# EAGLE design XBee_Ctrl_No_Magnetometer (EAGLE 6.2)
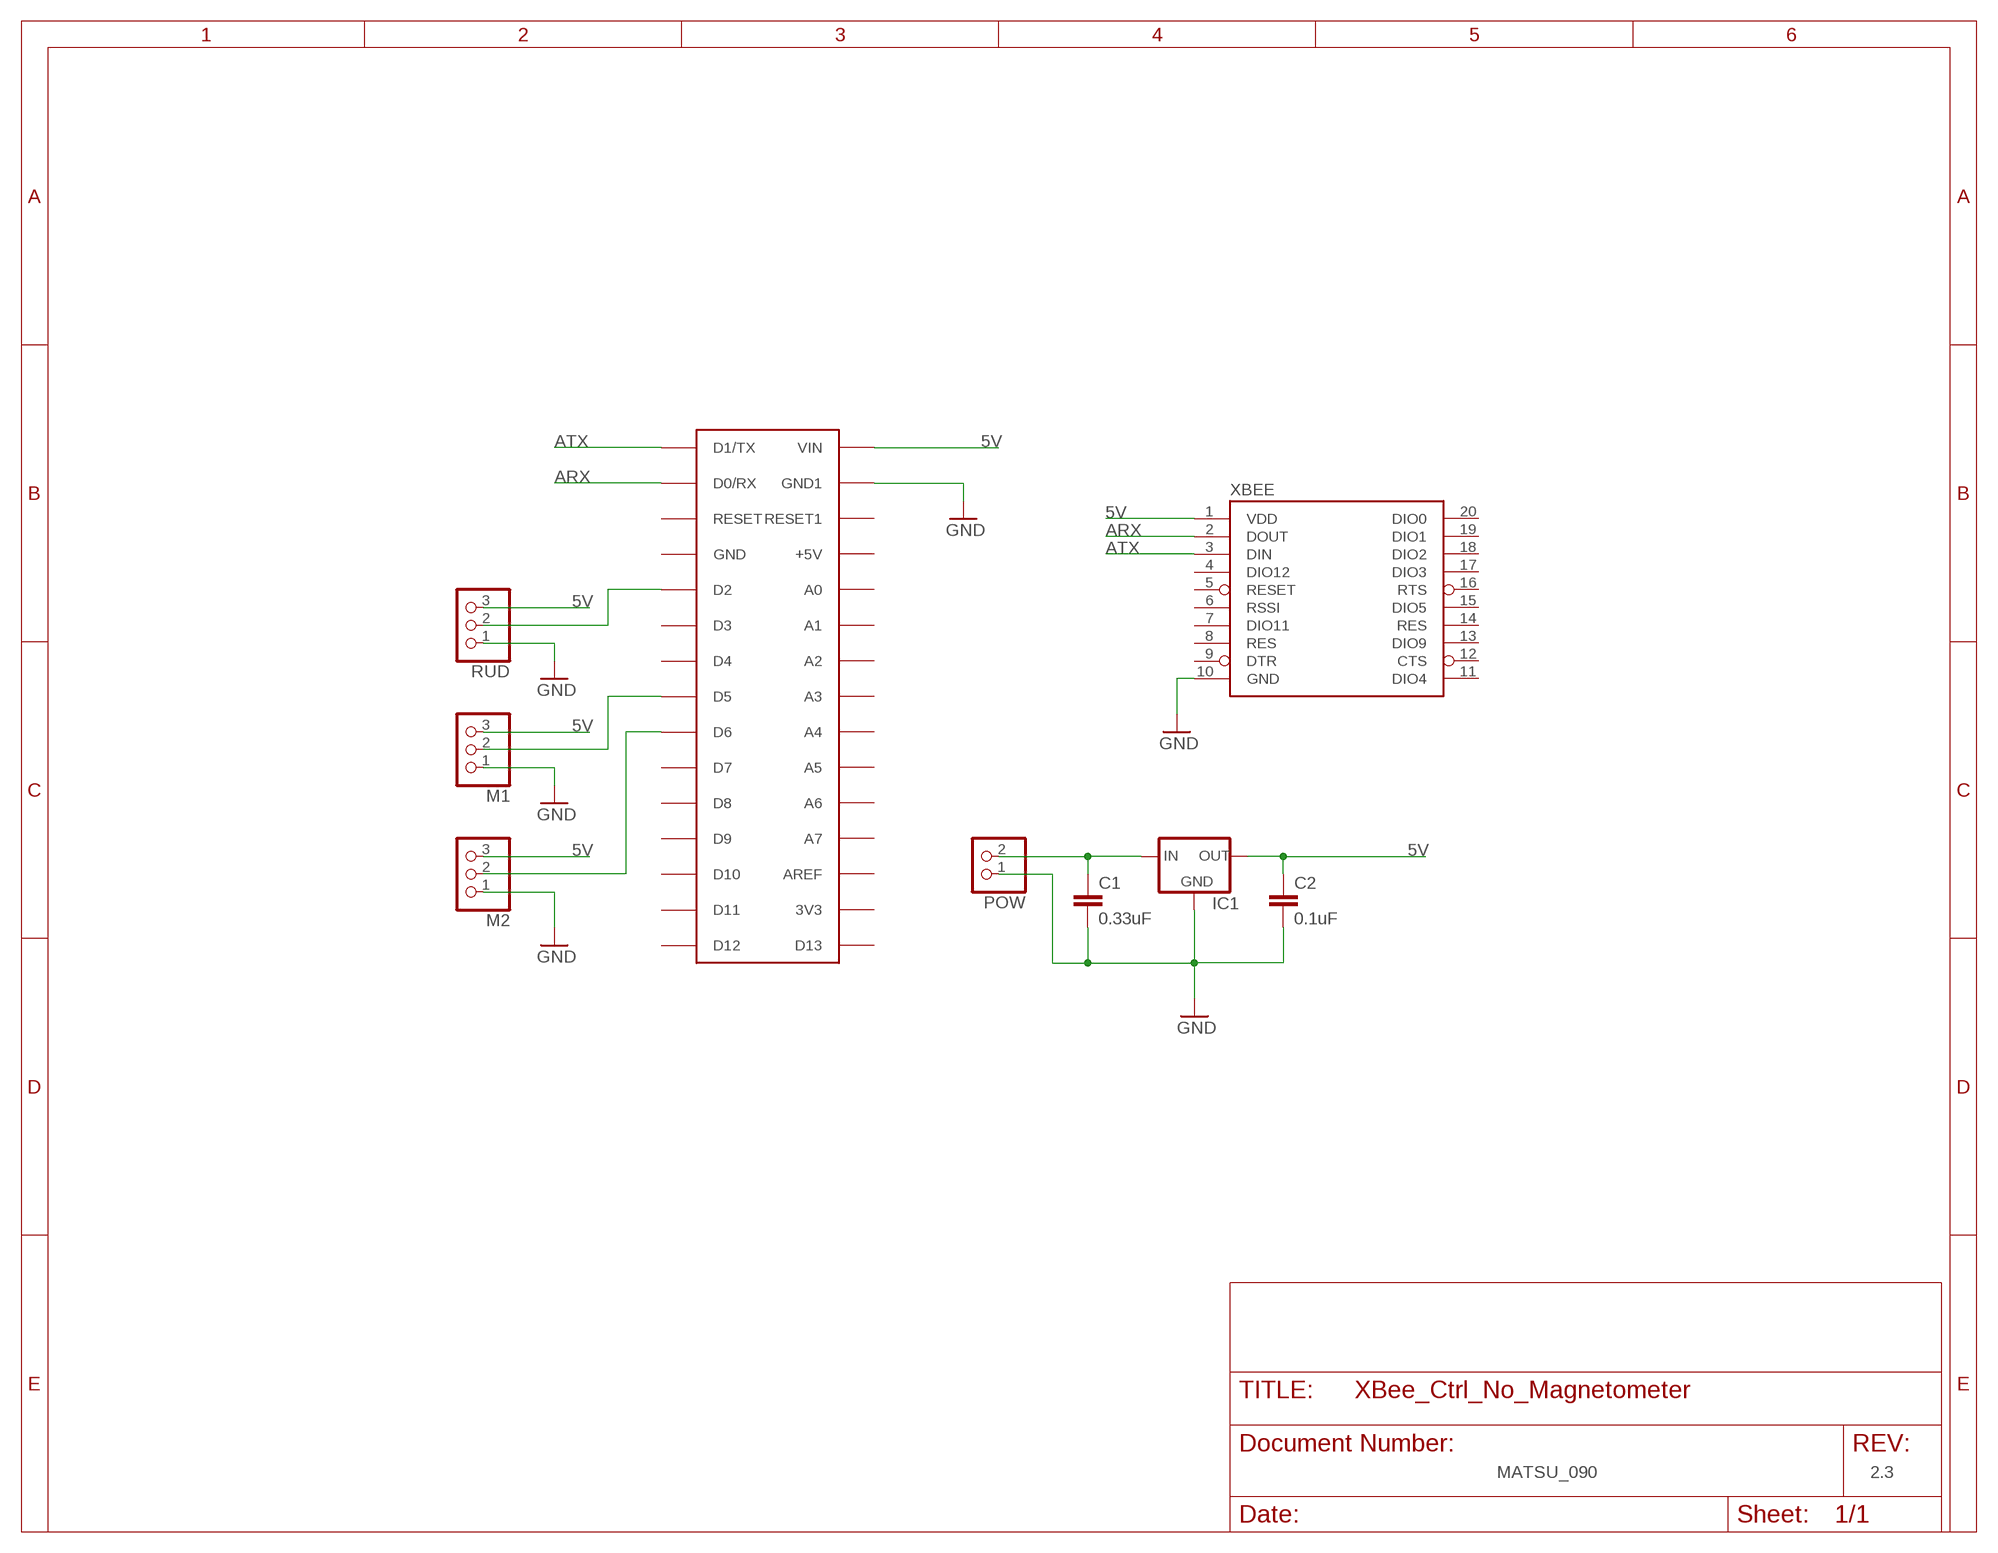
[diagram p0: schematic, sheet 1]
FRAME1 (FRAME_A_L): DOC#: MATSU_090; REV: 2.3

## Parts
C1  0.33uF  C5/2.5  [C5B2.5]
C2  0.1uF  C5/2.5  [C5B2.5]
IC1  78XXL  [78XXL]
M1  PINHD-1X3  [1X03]
M2  PINHD-1X3  [1X03]
NANO  ARDUINONANO  [PDIP-32]
POW  PINHD-1X2  [1X02]
RUD  PINHD-1X3  [1X03]
XBEE  XBEE-1B1  [XBEE-1]

## Nets
5V: C2.1 IC1.OUT M1.3 M2.3 NANO.VIN RUD.3 XBEE.1(VDD)
ARX: NANO.D0/RX XBEE.2(DOUT)
ATX: NANO.D1/TX XBEE.3(DIN)
GND: C1.2 C2.2 IC1.GND M1.1 M2.1 NANO.GND1 POW.1 RUD.1 XBEE.10(GND)
N$2: C1.1 IC1.IN POW.2
N$4: NANO.D2 RUD.2
N$5: M1.2 NANO.D5
N$6: M2.2 NANO.D6
Unconnected: NANO.3V3 NANO.+5V NANO.A0 NANO.A1 NANO.A2 NANO.A3 NANO.A4 NANO.A5 NANO.A6 NANO.A7 NANO.AREF NANO.D3 NANO.D4 NANO.D7 NANO.D8 NANO.D9 NANO.D10 NANO.D11 NANO.D12 NANO.D13 NANO.GND NANO.RESET NANO.RESET1 XBEE.4(DIO12) XBEE.5(RESET) XBEE.6(RSSI) XBEE.7(DIO11) XBEE.8(RES) XBEE.9(DTR) XBEE.11(DIO4) XBEE.12(CTS) XBEE.13(DIO9) XBEE.14(RES) XBEE.15(DIO5) XBEE.16(RTS) XBEE.17(DIO3) XBEE.18(DIO2) XBEE.19(DIO1) XBEE.20(DIO0)

## Library data of the parts
C1 C2 = capacitor-wima:C: CAPACITOR naming: grid - package width
IC1 = v-reg:78XXL: VOLTAGE REGULATOR
M1 M2 RUD = pinhead:PINHD-1X3: PIN HEADER
NANO = arduino_nano_rocketfarm:ARDUINONANO
POW = pinhead:PINHD-1X2: PIN HEADER
XBEE = Sparkfun_RF:XBEE-1: Xbee module footprints

## Board
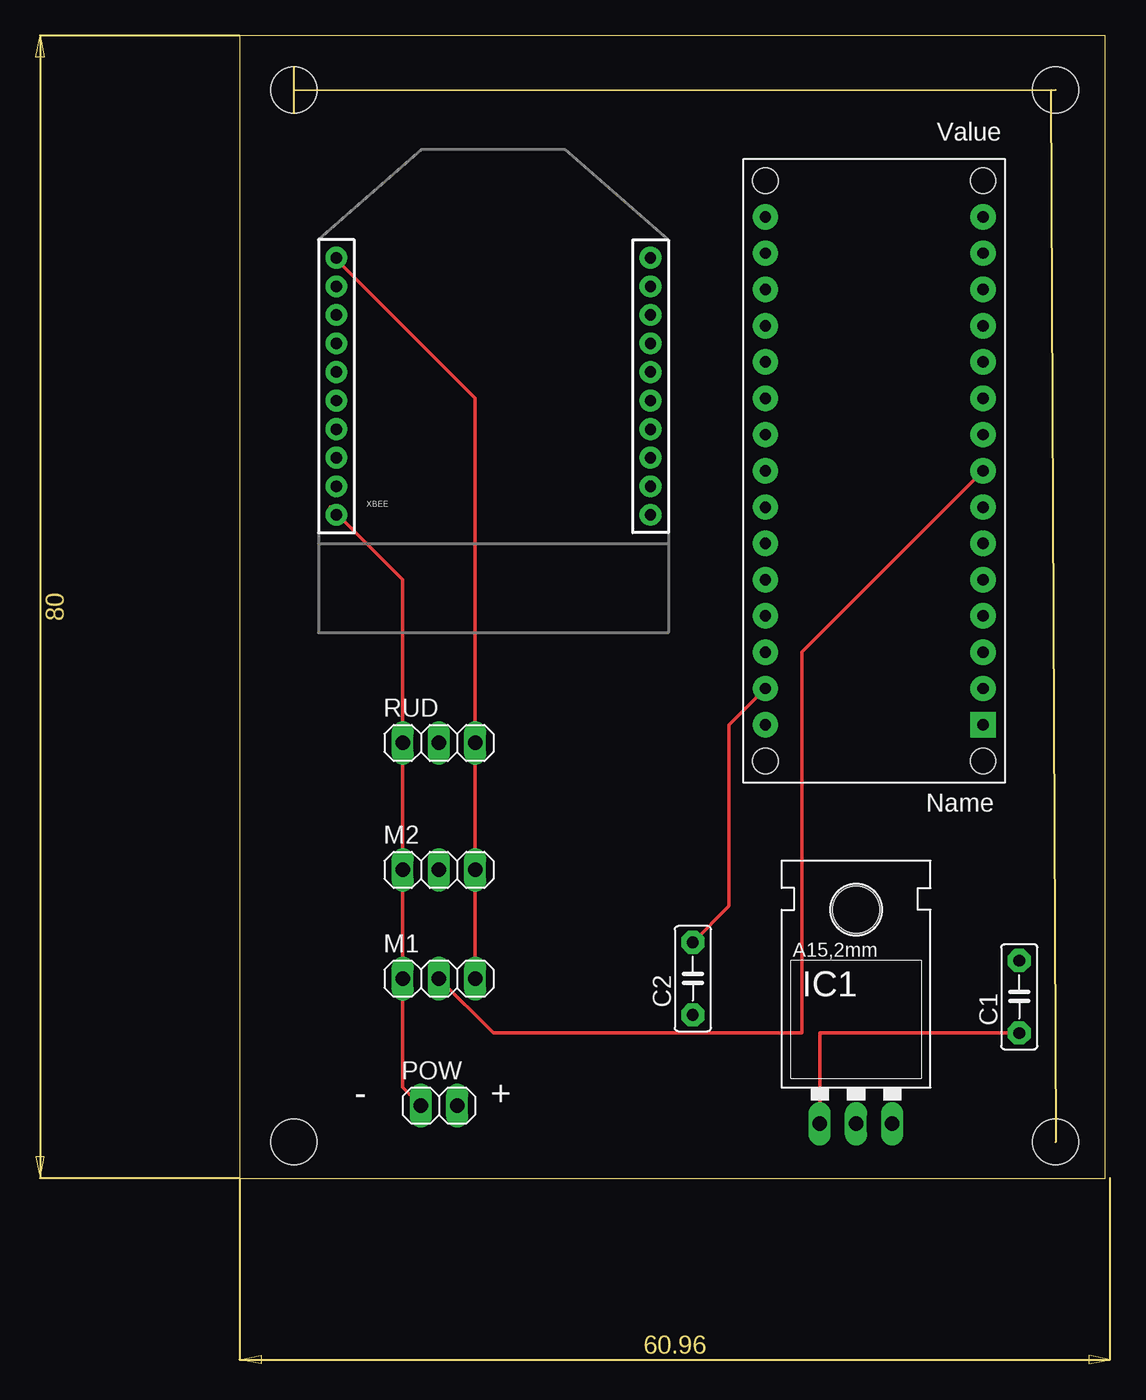
[diagram p1: board, top side]
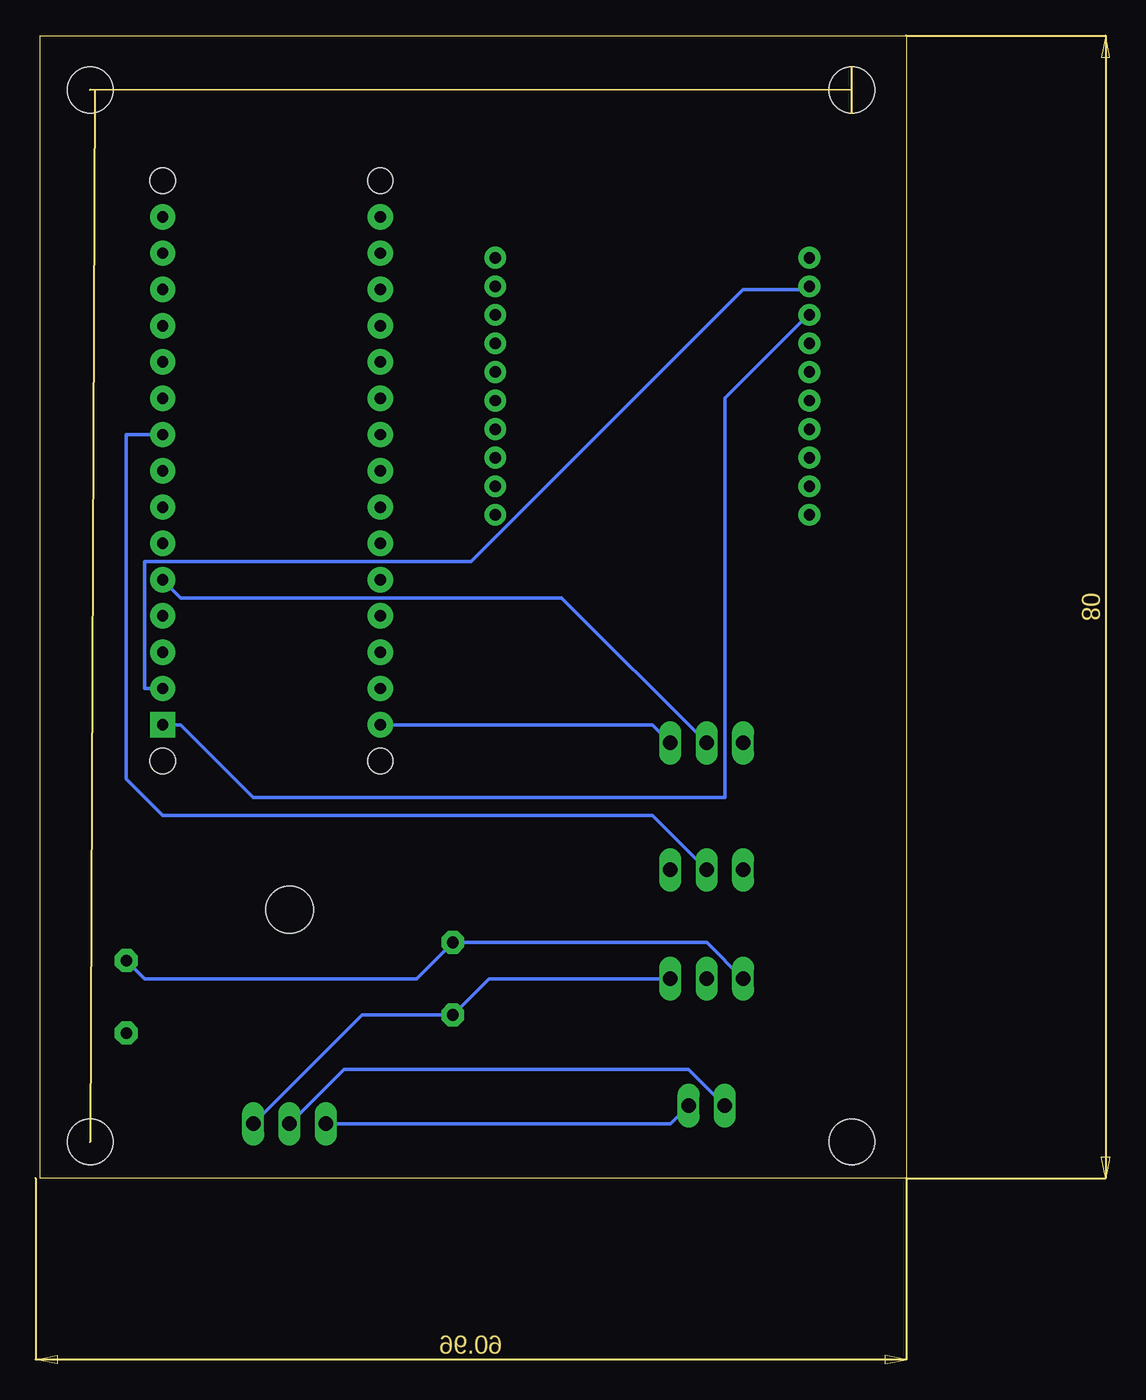
[diagram p2: board, bottom side, seen from below]

Size 60.63 x 80 mm. Coordinates in mm from the lower left corner, seen from the top.
Outline: 0,0 60.63,0 60.63,80 0,80 0,0
Copper layers (1*16): Top 0.035mm / dielectric 1.5mm / Bottom 0.035mm
Design rules: minimum track width 10mil, minimum drill 24mil, track to track 8mil, track to pad 8mil, pad to pad 8mil, via to via 8mil, smd to smd 8mil, copper to edge 40mil, drill to drill 8mil, minimum pad ring 10mil, minimum via ring 8mil, stop-mask expansion 4mil, vias tented up to drill 0mil, thermal gap 10mil
Holes 3.2 mm at 3.81,76.2 57.15,76.2 3.81,2.54 57.15,2.54

### Footprints (pad centres in the part's own frame; a part is rotated, then mirrored left to right if it is on the bottom)
C5B2.5 = drill 0.813 pad 1.6 octagon: 1 -2.54,0; 2 2.54,0
78XXL = drill 1.016 long: GND 0,-3.81; IN -2.54,-3.81; OUT 2.54,-3.81 | hole 3.302: 0,11.176
1X03 = drill 1.016 long: 1 -2.54,0; 2 0,0; 3 2.54,0
PDIP-32 = drill 0.8 pad 1.778: 3V3 15.24,-35.56; +5V 15.24,-10.16; A0 15.24,-12.7; A1 15.24,-15.24; A2 15.24,-17.78; A3 15.24,-20.32; A4 15.24,-22.86; A5 15.24,-25.4; A6 15.24,-27.94; A7 15.24,-30.48; AREF 15.24,-33.02; D0/RX 0,-5.08; D2 0,-12.7; D3 0,-15.24; D4 0,-17.78; D5 0,-20.32; D6 0,-22.86; D7 0,-25.4; D8 0,-27.94; D9 0,-30.48; D10 0,-33.02; D11 0,-35.56; D12 0,-38.1; D13 15.24,-38.1; GND 0,-10.16; GND1 15.24,-5.08; RESET 0,-7.62; RESET1 15.24,-7.62; VIN 15.24,-2.54 | drill 0.8 pad 1.778 square: D1/TX 0,-2.54 | hole 1.778: 0,0; 0,-40.64; 15.24,-40.64; 15.24,0
1X02 = drill 1.016 long: 1 -1.27,0; 2 1.27,0
XBEE-1 = drill 0.8 pad 1.524: 1 -11,20; 2 -11,18; 3 -11,16; 4 -11,14; 5 -11,12; 6 -11,10; 7 -11,8; 8 -11,6; 9 -11,4; 10 -11,2; 11 11,2; 12 11,4; 13 11,6; 14 11,8; 15 11,10; 16 11,12; 17 11,14; 18 11,16; 19 11,18; 20 11,20

### Placement (x,y rotation side)
C1  54.61,12.7 90 top
C2  31.75,13.97 90 top
IC1  43.18,7.62 0 top
M1  13.97,13.97 0 top
M2  13.97,21.59 0 top
NANO  52.07,29.21 180 top
POW  13.97,5.08 0 top
RUD  13.97,30.48 0 top
XBEE  17.78,44.45 0 top

### Tracks (layer width: path | path; a pad name or v marks a point on that pad's centre or on a via)
5V
  Top 0.254: M1.3 M2.3 RUD.3 16.51,54.61 6.35,64.77 XBEE.1
  Bottom 0.254: IC1.OUT 38.1,11.43 C2.1 29.21,13.97 M1.3 | NANO.VIN 17.78,31.75 RUD.3
ARX
  Bottom 0.254: NANO.D0/RX 53.34,34.29 53.34,43.18 30.48,43.18 11.43,62.23 6.35,62.23 XBEE.2
ATX
  Bottom 0.254: NANO.D1/TX 50.8,31.75 45.72,26.67 12.7,26.67 12.7,54.61 6.35,60.96 XBEE.3
GND
  Top 0.254: C2.2 34.29,19.05 34.29,31.75 NANO.GND1 | XBEE.10 6.35,46.99 11.43,41.91 RUD.1 M2.1 M1.1 11.43,6.35 POW.1
  Bottom 0.254: C1.2 53.34,13.97 34.29,13.97 C2.2 13.97,16.51 M1.1 | IC1.GND 39.37,7.62 15.24,7.62 POW.1
N$2
  Top 0.254: C1.1 40.64,10.16 IC1.IN
  Bottom 0.254: POW.2 16.51,3.81 IC1.IN
N$4
  Bottom 0.254: RUD.2 24.13,40.64 50.8,40.64 NANO.D2
N$5
  Top 0.254: M1.2 17.78,10.16 39.37,10.16 39.37,36.83 NANO.D5
N$6
  Bottom 0.254: M2.2 17.78,25.4 52.07,25.4 54.61,27.94 54.61,52.07 NANO.D6

### Text on the board
tNames: - | +